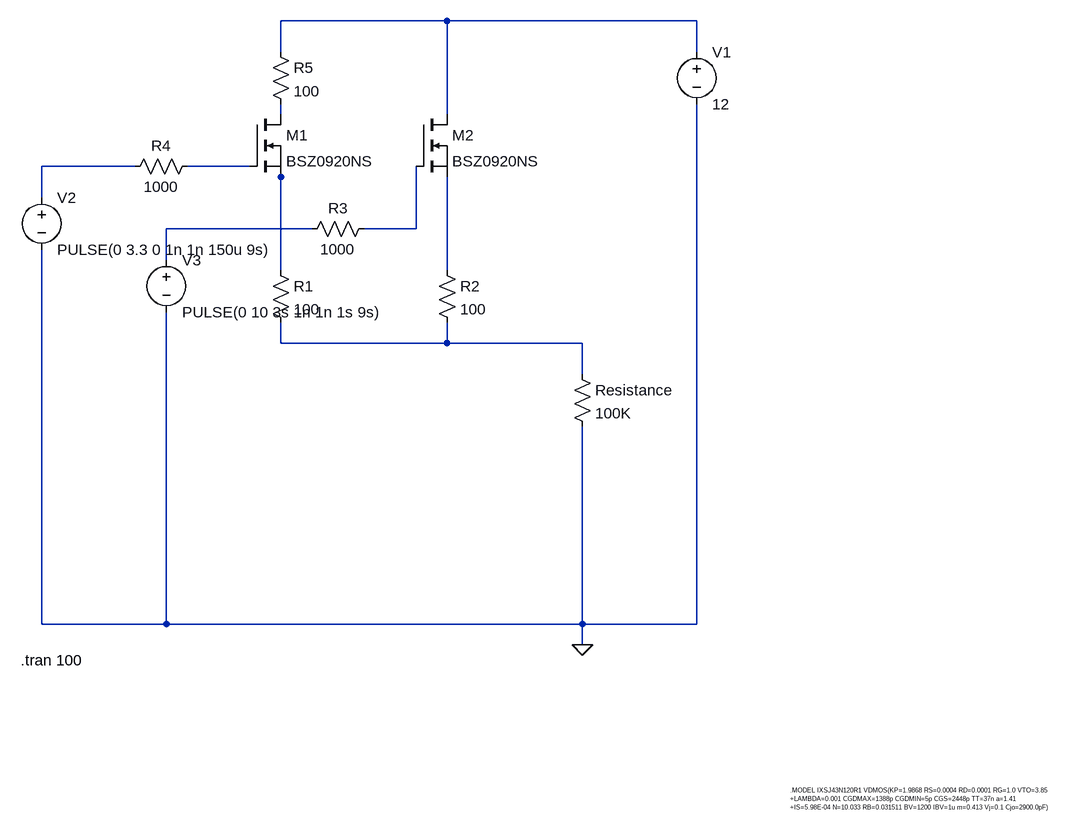
[diagram p0: schematic susanshore.asc]
susanshore.asc, the LTspice schematic file:
Version 4.1
SHEET 1 1320 1008
WIRE 176 -208 -80 -208
WIRE 560 -208 176 -208
WIRE -80 -160 -80 -208
WIRE 560 -160 560 -208
WIRE -80 -64 -80 -80
WIRE 176 -64 176 -208
WIRE -304 16 -448 16
WIRE -128 16 -224 16
WIRE -80 32 -80 16
WIRE -448 64 -448 16
WIRE -32 112 -256 112
WIRE 128 112 128 16
WIRE 128 112 48 112
WIRE -256 160 -256 112
WIRE -80 176 -80 32
WIRE 176 176 176 32
WIRE -80 288 -80 256
WIRE 176 288 176 256
WIRE 176 288 -80 288
WIRE 384 288 176 288
WIRE 384 336 384 288
WIRE -448 720 -448 144
WIRE -256 720 -256 240
WIRE -256 720 -448 720
WIRE 384 720 384 416
WIRE 384 720 -256 720
WIRE 560 720 560 -80
WIRE 560 720 384 720
WIRE 384 752 384 720
FLAG 384 752 0
SYMBOL nmos 128 -64 R0
SYMATTR InstName M2
SYMATTR Value BSZ0920NS
SYMBOL res -96 160 R0
SYMATTR InstName R1
SYMATTR Value 100
SYMBOL res 160 160 R0
SYMATTR InstName R2
SYMATTR Value 100
SYMBOL res 368 320 R0
SYMATTR InstName Resistance
SYMATTR Value 100K
SYMBOL voltage 560 -176 R0
WINDOW 123 0 0 Left 0
WINDOW 39 0 0 Left 0
SYMATTR InstName V1
SYMATTR Value 12
SYMBOL voltage -448 48 R0
WINDOW 123 0 0 Left 0
WINDOW 39 0 0 Left 0
SYMATTR InstName V2
SYMATTR Value PULSE(0 3.3 0 1n 1n 150u 9s)
SYMBOL voltage -256 144 R0
WINDOW 123 0 0 Left 0
WINDOW 39 0 0 Left 0
SYMATTR InstName V3
SYMATTR Value PULSE(0 10 3s 1n 1n 1s 9s)
SYMBOL res -208 0 R90
WINDOW 0 0 56 VBottom 2
WINDOW 3 32 56 VTop 2
SYMATTR InstName R4
SYMATTR Value 1000
SYMBOL nmos -128 -64 R0
SYMATTR InstName M1
SYMATTR Value BSZ0920NS
SYMBOL res 64 96 R90
WINDOW 0 0 56 VBottom 2
WINDOW 3 32 56 VTop 2
SYMATTR InstName R3
SYMATTR Value 1000
SYMBOL res -96 -176 R0
SYMATTR InstName R5
SYMATTR Value 100
TEXT -480 776 Left 2 !.tran 100
TEXT 704 976 Left 0 !.MODEL IXSJ43N120R1 VDMOS(KP=1.9868 RS=0.0004 RD=0.0001 RG=1.0 VTO=3.85 \n+LAMBDA=0.001 CGDMAX=1388p CGDMIN=5p CGS=2448p TT=37n a=1.41\n+IS=5.98E-04 N=10.033 RB=0.031511 BV=1200 IBV=1u m=0.413 Vj=0.1 Cjo=2900.0pF)

The netlist it stands for:
* susanshore.asc
M2 N001 N007 N008 N008 BSZ0920NS
R1 N005 N009 100
R2 N008 N009 100
Resistance N009 0 100K
V1 N001 0 12
V2 N003 0 PULSE(0 3.3 0 1n 1n 150u 9s)
V3 N006 0 PULSE(0 10 3s 1n 1n 1s 9s)
R4 N004 N003 1000
M1 N002 N004 N005 N005 BSZ0920NS
R3 N007 N006 1000
R5 N001 N002 100
.model NMOS NMOS
.model PMOS PMOS
.lib standard.mos
.tran 100
.MODEL IXSJ43N120R1 VDMOS(KP=1.9868 RS=0.0004 RD=0.0001 RG=1.0 VTO=3.85
+LAMBDA=0.001 CGDMAX=1388p CGDMIN=5p CGS=2448p TT=37n a=1.41
+IS=5.98E-04 N=10.033 RB=0.031511 BV=1200 IBV=1u m=0.413 Vj=0.1 Cjo=2900.0pF)
.backanno
.end